# Altium schematic sheet HardwareSchematic.SchDoc
size A4; SheetNumber: 1; SheetTotal: 2
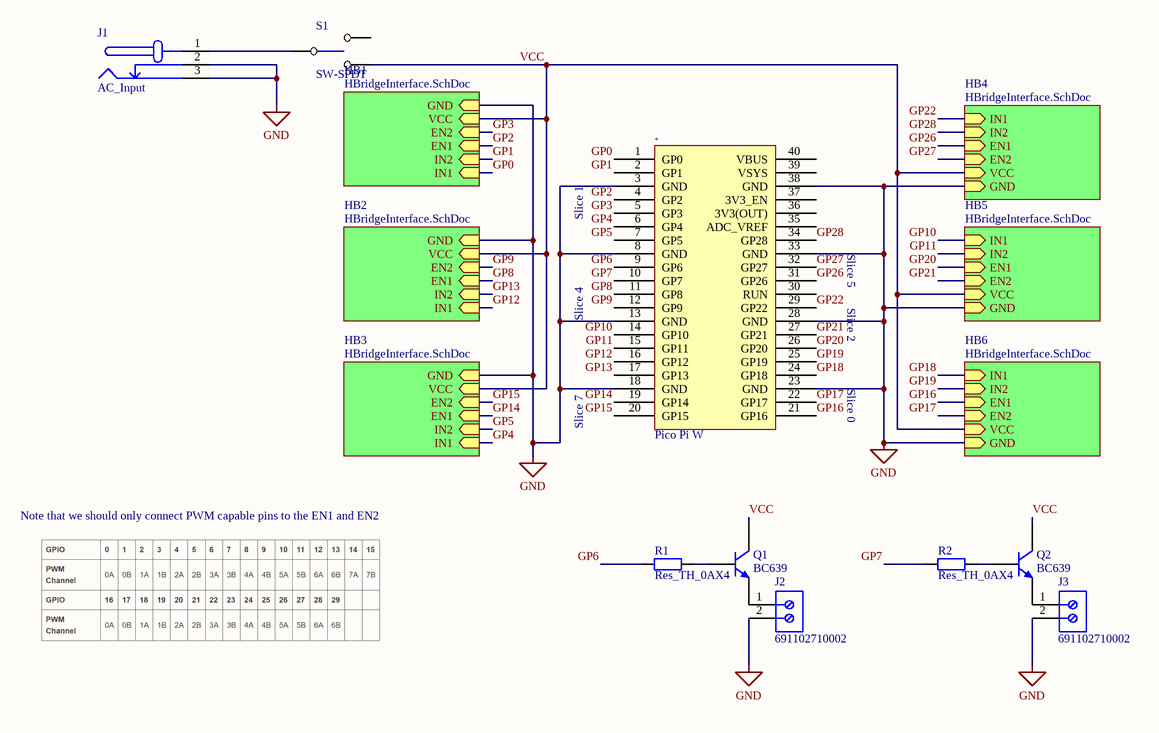
[diagram p0: HardwareSchematic.SchDoc]

## Parts
*  Pico Pi W  [New footprint 1]
J1  AC_Input  [AC-Socket]
J2  691102710002  [691102710002]
J3  691102710002  [691102710002]
Q1  BC639  [TO-92R]
Q2  BC639  [TO-92R]
R1  Res_TH_0AX4  [AXIAL-0.4]
R2  Res_TH_0AX4  [AXIAL-0.4]
S1  SW-SPDT  [SW-SPDT]

## Sub-sheets
HB1 = HBridgeInterface.SchDoc: IN1 (in), IN2 (in), EN1 (in), EN2 (in), VCC (in), GND (in)
HB2 = HBridgeInterface.SchDoc: IN1 (in), IN2 (in), EN1 (in), EN2 (in), VCC (in), GND (in)
HB3 = HBridgeInterface.SchDoc: IN1 (in), IN2 (in), EN1 (in), EN2 (in), VCC (in), GND (in)
HB4 = HBridgeInterface.SchDoc: IN1 (in), IN2 (in), EN1 (in), EN2 (in), VCC (in), GND (in)
HB5 = HBridgeInterface.SchDoc: IN1 (in), IN2 (in), EN1 (in), EN2 (in), VCC (in), GND (in)
HB6 = HBridgeInterface.SchDoc: IN1 (in), IN2 (in), EN1 (in), EN2 (in), VCC (in), GND (in)

## Nets
GND: *.3(GND) *.8(GND) *.13(GND) *.18(GND) *.23(GND) *.28(GND) *.33(GND) *.38(GND) J1.2(GND_ALT) J1.3(GND) J2.2 J3.2 ; sheet HB1/GND, sheet HB2/GND, sheet HB3/GND, sheet HB5/GND, sheet HB6/GND, sheet HB4/GND
GP0: *.1(GP0) ; sheet HB1/IN1
GP1: *.2(GP1) ; sheet HB1/IN2
GP2: *.4(GP2) ; sheet HB1/EN1
GP3: *.5(GP3) ; sheet HB1/EN2
GP4: *.6(GP4) ; sheet HB3/IN1
GP5: *.7(GP5) ; sheet HB3/IN2
GP6: *.9(GP6) R1.1
GP7: *.10(GP7) R2.1
GP8: *.11(GP8) ; sheet HB2/EN1
GP9: *.12(GP9) ; sheet HB2/EN2
GP10: *.14(GP10) ; sheet HB5/IN1
GP11: *.15(GP11) ; sheet HB5/IN2
GP12: *.16(GP12) ; sheet HB2/IN1
GP13: *.17(GP13) ; sheet HB2/IN2
GP14: *.19(GP14) ; sheet HB3/EN1
GP15: *.20(GP15) ; sheet HB3/EN2
GP16: *.21(GP16) ; sheet HB6/EN1
GP17: *.22(GP17) ; sheet HB6/EN2
GP18: *.24(GP18) ; sheet HB6/IN1
GP19: *.25(GP19) ; sheet HB6/IN2
GP20: *.26(GP20) ; sheet HB5/EN1
GP21: *.27(GP21) ; sheet HB5/EN2
GP22: *.29(GP22) ; sheet HB4/IN1
GP26: *.31(GP26) ; sheet HB4/EN1
GP27: *.32(GP27) ; sheet HB4/EN2
GP28: *.34(GP28) ; sheet HB4/IN2
VCC: Q1.2(C) Q2.2(C) S1.3 ; sheet HB1/VCC, sheet HB2/VCC, sheet HB3/VCC, sheet HB5/VCC, sheet HB6/VCC, sheet HB4/VCC
NetJ1_1: J1.1(VCC) S1.2
NetJ2_1: J2.1 Q1.3(E)
NetJ3_1: J3.1 Q2.3(E)
NetQ1_1: Q1.1(B) R1.2
NetQ2_1: Q2.1(B) R2.2

Not connected (* = marked no-connect by the designer): * 30(RUN) 35(ADC_VREF) 36(3V3(OUT)) 37(3V3_EN) 39(VSYS) 40(VBUS); S1 1

## Notes on the sheet
- Slice 1
- Slice 5
- Slice 4
- Slice 2
- Slice 7
- Slice 0
- Note that we should only connect PWM capable pins to the EN1 and EN2

## Library data of the parts
* = Pico-Pi-W-1: micro
J1 = CMP-007-000005-1: DC barrel jack connection to AC source; Value: socket; Component Type: Standard; Design Item ID: AC_Input; Source: EE209_SchLib.SchLib; Pin Count: 3
J2 J3 = CMP-1502-03258-2: NexarPartId: 8917706; Number of Levels: 1; Number of Positions Per Level: 2; Current: 15A; Voltage: 300V; Pitch: 5.0038mm; Plating: Steel; Stripping Length: -6mm; Wire Gauge (Min): 14AWG; Wire Gauge (Max): 22AWG; Length: 7.5mm; Contact Material: Brass; Contact Plating: Tin; Packaging: Box; Number of Pins: 2; Voltage Rating: 300V; Termination: Screw; Number of Contacts: 2; Color: Blue; Current Rating: 15A; Mount: Through Hole; Max Operating Temperature: 105°C; Min Operating Temperature: -40°C; REACH SVHC: Unknown; Height: 13.4mm; Width: 11.2mm; Housing Material: Nylon; RoHS: Compliant; Wire/Cable Gauge: 22AWG; Lead Pitch: 5mm
Q1 Q2 = CMP-026-000003-1: High Current Transistor NPN Silicon; PackageDocument: 1996; LatestRevisionDate: 17-Jul-2002; Publisher: Altium Limited; LatestRevisionNote: Re-released for DXP Platform.; Component Type: Standard; Pin Count: 3; PackageReference: 29-04; Source: COMSYS301.SCHLIB; ComponentLink1URL: http://www.motorola.com/; Published: 29-Sep-2000; Design Item ID: BC639; ComponentLink1Description: Manufacturer Link; DatasheetDocument: Nov-1999
R1 R2 = CMP-019-000001-1: Through hole resistor; Source: EE209_SchLib.SchLib; Pin Count: 2; PackageReference: AXIAL-0.4; Design Item ID: Res_TH_0AX4; LatestRevisionDate: 17-Jul-2002; Component Type: Standard; Published: 8-Jun-2000; Value: *; Publisher: Altium Limited; LatestRevisionNote: Re-released for DXP Platform.
S1 = CMP-025-000001-1: Toggle Switch; Source: COMSYS301.SCHLIB; Pin Count: 3; Component Type: Standard; Design Item ID: SW-SPDT